# Altium schematic sheet relay_bridge.SchDoc
size A4; SheetNumber: 5; SheetTotal: 14
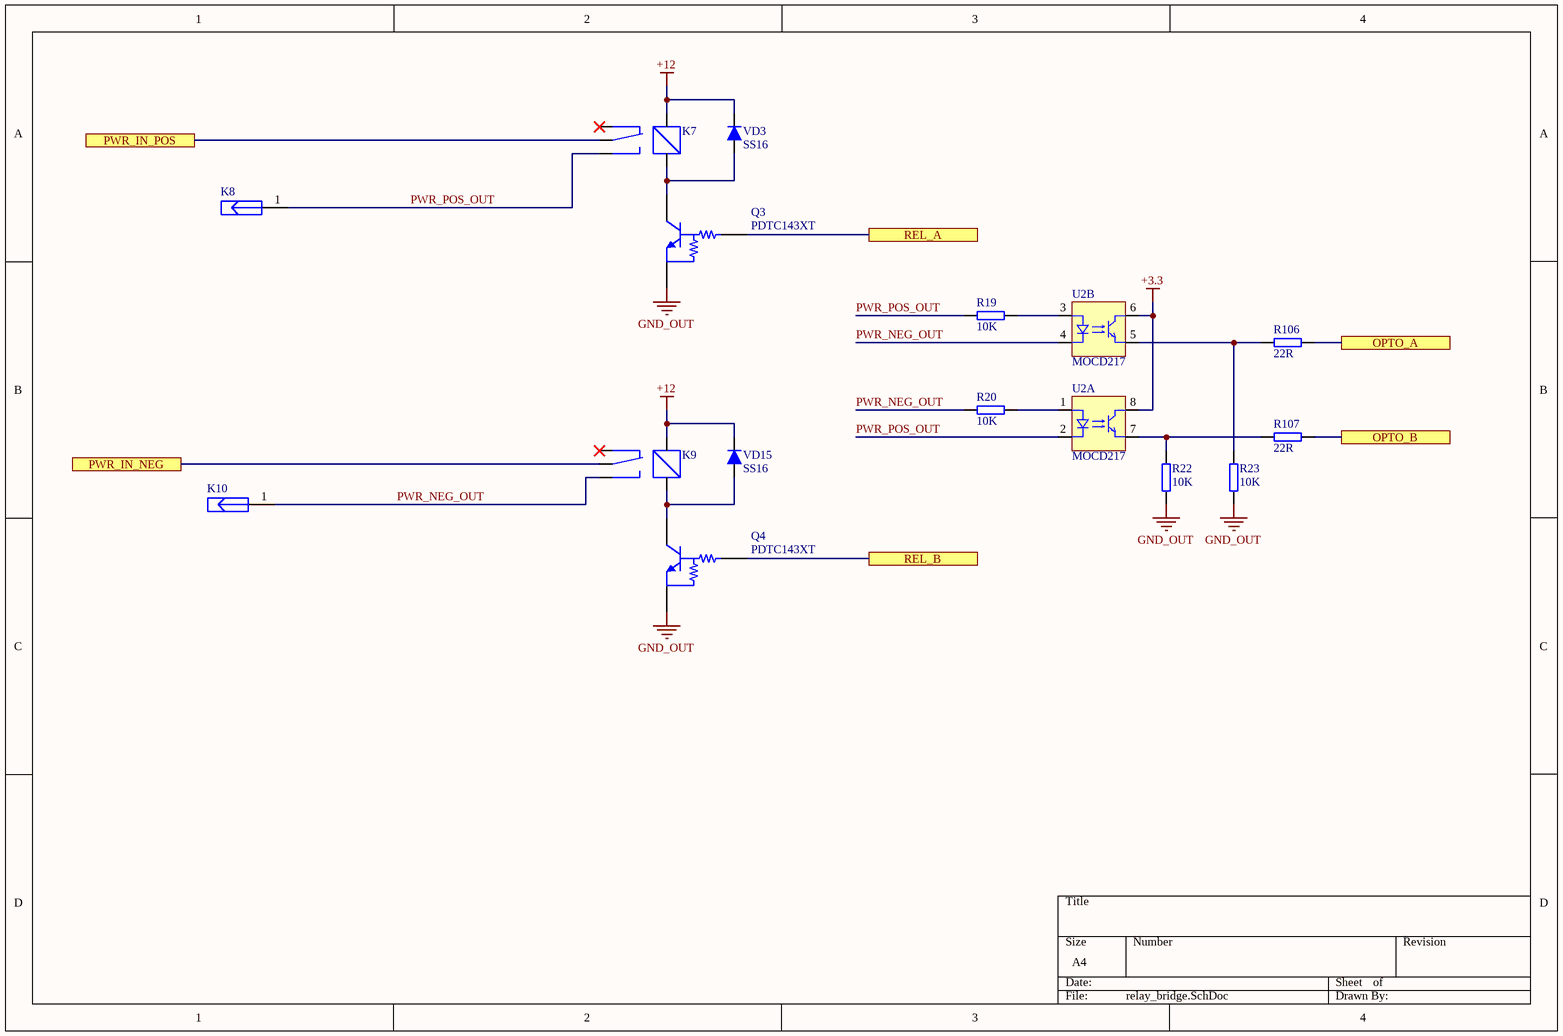
[diagram p0: relay_bridge.SchDoc]

## Parts
K7  (no value)  [REL: SRD-03VDC]
K8  (no value)  [CON: 8191]
K9  (no value)  [REL: SRD-03VDC]
K10  (no value)  [CON: 8191]
Q3  PDTC143XT  [SOT23_N]
Q4  PDTC143XT  [SOT23_N]
R19  10K  [RES: 0603]
R20  10K  [RES: 0603]
R22  10K  [RES: 0603]
R23  10K  [RES: 0603]
R106  22R  [RES: 0603]
R107  22R  [RES: 0603]
U2  MOCD217  [8-SOIC]  (parts A,B of 2)
VD3  SS16  [DIODE: SMA]
VD15  SS16  [DIODE: SMA]

## Ports
OPTO_A, OPTO_B, PWR_IN_NEG, PWR_IN_POS, REL_A, REL_B

## Nets
+3.3: U2.6(C) U2.8(C)
+12: K7.1(a) K9.1(a) VD3.2(C) VD15.2(C)
GND_OUT: Q3.2(E) Q4.2(E) R22.2 R23.2
OPTO_A: R106.1 ; port OPTO_A
OPTO_B: R107.1 ; port OPTO_B
PWR_IN_NEG: K9.3(O) ; port PWR_IN_NEG
PWR_IN_POS: K7.3(O) ; port PWR_IN_POS
PWR_NEG_OUT: K9.5(NO) K10.1 R20.2 U2.4(K)
PWR_POS_OUT: K7.5(NO) K8.1 R19.2 U2.2(K)
REL_A: Q3.1(B) ; port REL_A
REL_B: Q4.1(B) ; port REL_B
NetK7_2: K7.2(b) Q3.3(C) VD3.1(A)
NetK9_2: K9.2(b) Q4.3(C) VD15.1(A)
NetR19_1: R19.1 U2.3(A)
NetR20_1: R20.1 U2.1(A)
NetR22_1: R22.1 R107.2 U2.7(E)
NetR23_1: R23.1 R106.2 U2.5(E)

Not connected (* = marked no-connect by the designer): K7 4(NC)*; K9 4(NC)*

## Library data of the parts
K7 K9 = Relay
K8 K10 = PCB CON
Q3 Q4 = PDTC143XT: NPN Resistor-equipped Transistor; Published: 17-Sep-2003; LatestRevisionDate: 12-Dec-2006; LatestRevisionNote: IPC-7351 Footprint Added.; DatasheetVersion: 20-Apr-1999; PackageVersion: May-1999; PackageReference: SOT23; Publisher: Altium Limited; PackageDescription: 3-Pin SOT-23 Package 0.95 mm Pitch, 2.3 mm Lead Span; ComponentLink1Description: Manufacturer Link; ComponentLink1URL: http://www.semiconductors.philips.com/; ComponentLink2Description: Datasheet; ComponentLink2URL: http://www.semiconductors.philips.com/acrobat/datasheets/PDTC143X_SERIES_8.pdf
R19 R20 R22 R23 R106 R107 = R_SMD
  R19 R20 R22 R23: Value: 10K
  R106 R107: Value: 22R
VD3 VD15 = DIODE_SMD: Value: SS16
U2 = MOCD217: Value: MOCD217